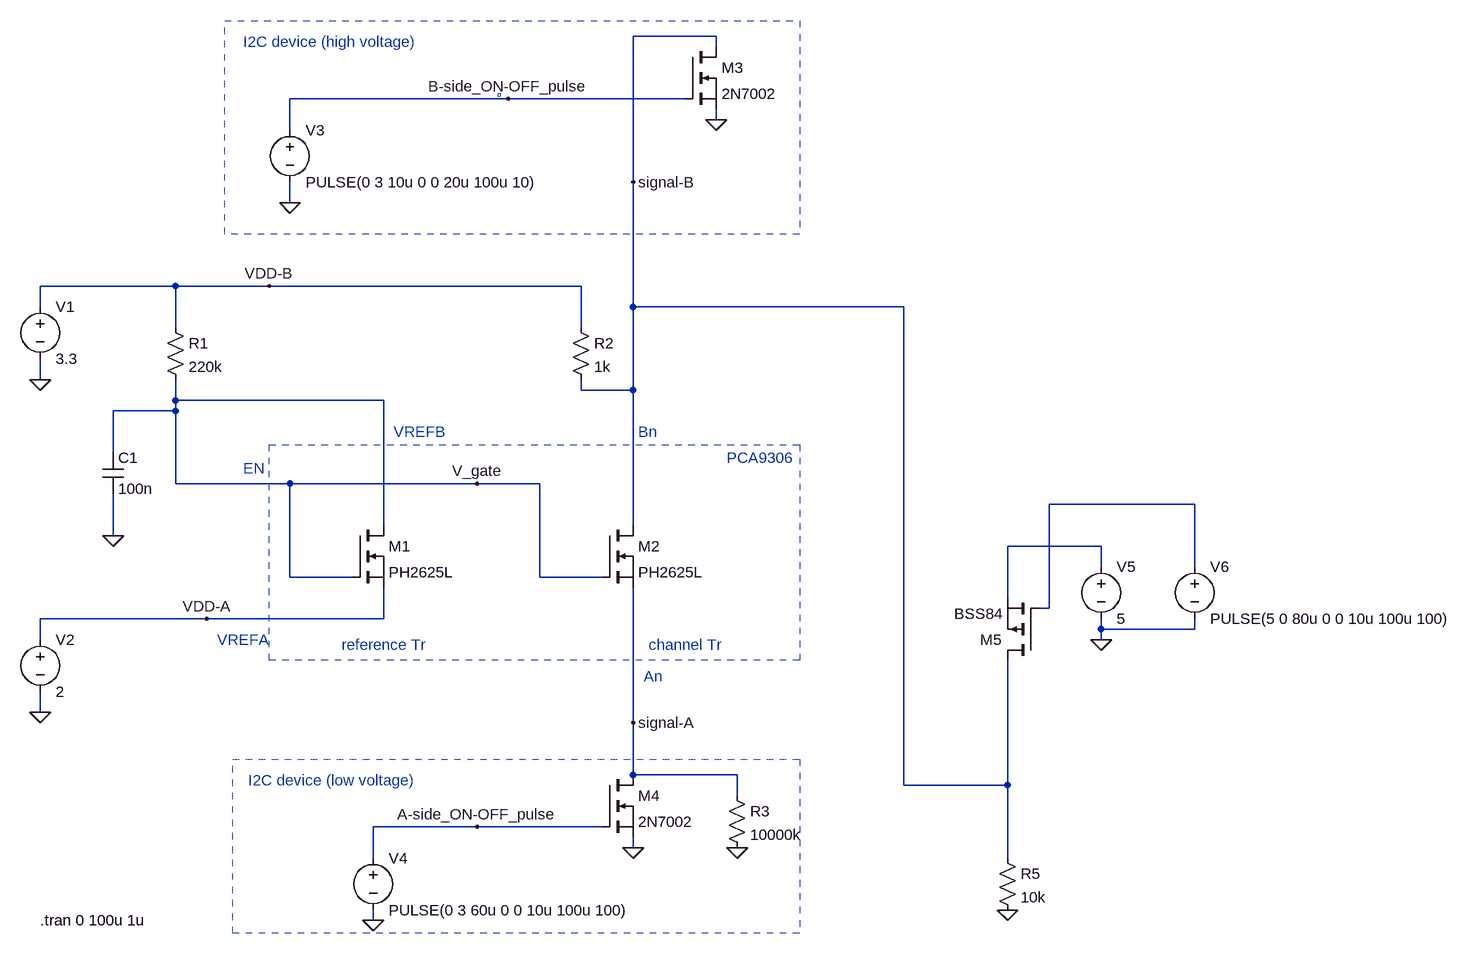
[diagram p0: schematic pca9306_operation_adding_over_voltage_on_B_side.asc]
pca9306_operation_adding_over_voltage_on_B_side.asc, the LTspice schematic file:
Version 4
SHEET 1 1768 856
WIRE 624 -528 496 -528
WIRE 624 -512 624 -528
WIRE 304 -432 -32 -432
WIRE 576 -432 304 -432
WIRE 624 -400 624 -416
WIRE -32 -384 -32 -432
WIRE 496 -304 496 -528
WIRE -32 -272 -32 -304
WIRE -208 -144 -416 -144
WIRE -64 -144 -208 -144
WIRE 416 -144 -64 -144
WIRE -416 -112 -416 -144
WIRE 496 -112 496 -304
WIRE 912 -112 496 -112
WIRE -208 -80 -208 -144
WIRE 416 -80 416 -144
WIRE -416 0 -416 -32
WIRE 416 16 416 0
WIRE 496 16 496 -112
WIRE 496 16 416 16
WIRE -208 32 -208 0
WIRE 112 32 -208 32
WIRE -208 48 -208 32
WIRE -208 48 -304 48
WIRE -304 112 -304 48
WIRE -208 160 -208 48
WIRE -32 160 -208 160
WIRE 256 160 -32 160
WIRE 352 160 256 160
WIRE 1360 192 1136 192
WIRE 112 224 112 32
WIRE 496 224 496 16
WIRE -304 240 -304 176
WIRE 1216 256 1072 256
WIRE 1216 288 1216 256
WIRE 1360 288 1360 192
WIRE -32 304 -32 160
WIRE 64 304 -32 304
WIRE 352 304 352 160
WIRE 448 304 352 304
WIRE 1072 336 1072 256
WIRE 1136 352 1136 192
WIRE 1136 352 1120 352
WIRE -160 368 -416 368
WIRE 112 368 112 320
WIRE 112 368 -160 368
WIRE 1216 384 1216 368
WIRE 1360 384 1360 368
WIRE 1360 384 1216 384
WIRE -416 400 -416 368
WIRE 1216 400 1216 384
WIRE -416 512 -416 480
WIRE 496 528 496 320
WIRE 496 608 496 528
WIRE 656 608 496 608
WIRE 912 624 912 -112
WIRE 1072 624 1072 432
WIRE 1072 624 912 624
WIRE 656 640 656 608
WIRE 256 688 96 688
WIRE 448 688 256 688
WIRE 496 720 496 704
WIRE 96 736 96 688
WIRE 1072 736 1072 624
WIRE 96 832 96 816
FLAG -416 0 0
FLAG -416 512 0
FLAG 624 -400 0
FLAG 496 720 0
FLAG -304 240 0
FLAG -32 -272 0
FLAG 96 832 0
FLAG 496 -304 signal-B
FLAG 496 528 signal-A
FLAG -64 -144 VDD-B
FLAG -160 368 VDD-A
FLAG 256 160 V_gate
FLAG 304 -432 B-side_ON-OFF_pulse
FLAG 256 688 A-side_ON-OFF_pulse
FLAG 656 720 0
FLAG 1072 816 0
FLAG 1216 400 0
SYMBOL voltage -416 -128 R0
SYMATTR InstName V1
SYMATTR Value 3.3
SYMBOL voltage -416 384 R0
SYMATTR InstName V2
SYMATTR Value 2
SYMBOL res -224 -96 R0
SYMATTR InstName R1
SYMATTR Value 220k
SYMBOL res 400 -96 R0
SYMATTR InstName R2
SYMATTR Value 1k
SYMBOL nmos 576 -512 R0
SYMATTR InstName M3
SYMATTR Value 2N7002
SYMBOL nmos 448 608 R0
SYMATTR InstName M4
SYMATTR Value 2N7002
SYMBOL cap -320 112 R0
SYMATTR InstName C1
SYMATTR Value 100n
SYMBOL voltage -32 -400 R0
SYMATTR InstName V3
SYMATTR Value PULSE(0 3 10u 0 0 20u 100u 10)
SYMBOL voltage 96 720 R0
SYMATTR InstName V4
SYMATTR Value PULSE(0 3 60u 0 0 10u 100u 100)
SYMBOL nmos 64 224 R0
SYMATTR InstName M1
SYMATTR Value PH2625L
SYMBOL nmos 448 224 R0
SYMATTR InstName M2
SYMATTR Value PH2625L
SYMBOL res 640 624 R0
SYMATTR InstName R3
SYMATTR Value 10000k
SYMBOL res 1056 720 R0
SYMATTR InstName R5
SYMATTR Value 10k
SYMBOL voltage 1216 272 R0
SYMATTR InstName V5
SYMATTR Value 5
SYMBOL voltage 1360 272 R0
SYMATTR InstName V6
SYMATTR Value PULSE(5 0 80u 0 0 10u 100u 100)
SYMBOL pmos 1120 432 R180
SYMATTR InstName M5
SYMATTR Value BSS84
TEXT 48 408 Left 2 ;reference Tr
TEXT 520 408 Left 2 ;channel Tr
TEXT -416 832 Left 2 !.tran 0 100u 1u
TEXT 640 120 Left 2 ;PCA9306
TEXT 128 80 Left 2 ;VREFB
TEXT -104 136 Left 2 ;EN
TEXT -144 400 Left 2 ;VREFA
TEXT 504 80 Left 2 ;Bn
TEXT 512 456 Left 2 ;An
TEXT -104 -520 Left 2 ;I2C device (high voltage)
TEXT -96 616 Left 2 ;I2C device (low voltage)
RECTANGLE Normal 292 -440 288 -436 2
RECTANGLE Normal 752 432 -64 100 2
RECTANGLE Normal 752 -224 -132 -552 2
RECTANGLE Normal 752 852 -120 584 2

The netlist it stands for:
* pca9306_operation_adding_over_voltage_on_B_side.asc
V1 VDD-B 0 3.3
V2 VDD-A 0 2
R1 VDD-B V_gate 220k
R2 VDD-B signal-B 1k
M3 signal-B B-side_ON-OFF_pulse 0 0 2N7002
M4 signal-A A-side_ON-OFF_pulse 0 0 2N7002
C1 V_gate 0 100n
V3 B-side_ON-OFF_pulse 0 PULSE(0 3 10u 0 0 20u 100u 10)
V4 A-side_ON-OFF_pulse 0 PULSE(0 3 60u 0 0 10u 100u 100)
M1 V_gate V_gate VDD-A VDD-A PH2625L
M2 signal-B V_gate signal-A signal-A PH2625L
R3 signal-A 0 10000k
R5 signal-B 0 10k
V5 N002 0 5
V6 N001 0 PULSE(5 0 80u 0 0 10u 100u 100)
M5 signal-B N001 N002 N002 BSS84
.model NMOS NMOS
.model PMOS PMOS
.lib standard.mos
* reference Tr
* channel Tr
.tran 0 100u 1u
* PCA9306
* VREFB
* EN
* VREFA
* Bn
* An
* I2C device (high voltage)
* I2C device (low voltage)
.backanno
.end